# Altium schematic sheet 40_PP1_PWR.SchDoc
size 419 x 296 mm; Author: Serbinov O.A.; CompanyName: ELSICOM; DrawnBy: Serbinov O.A.; Engineer: Serbinov O.A.; Organization: Elsicom; Address1: Kirova avenue, 58; Address2: Tomsk; Address3: Russia 634012; DocumentNumber: 41; SheetNumber: 41; SheetTotal: 44; ProjectName: 48_PORTS
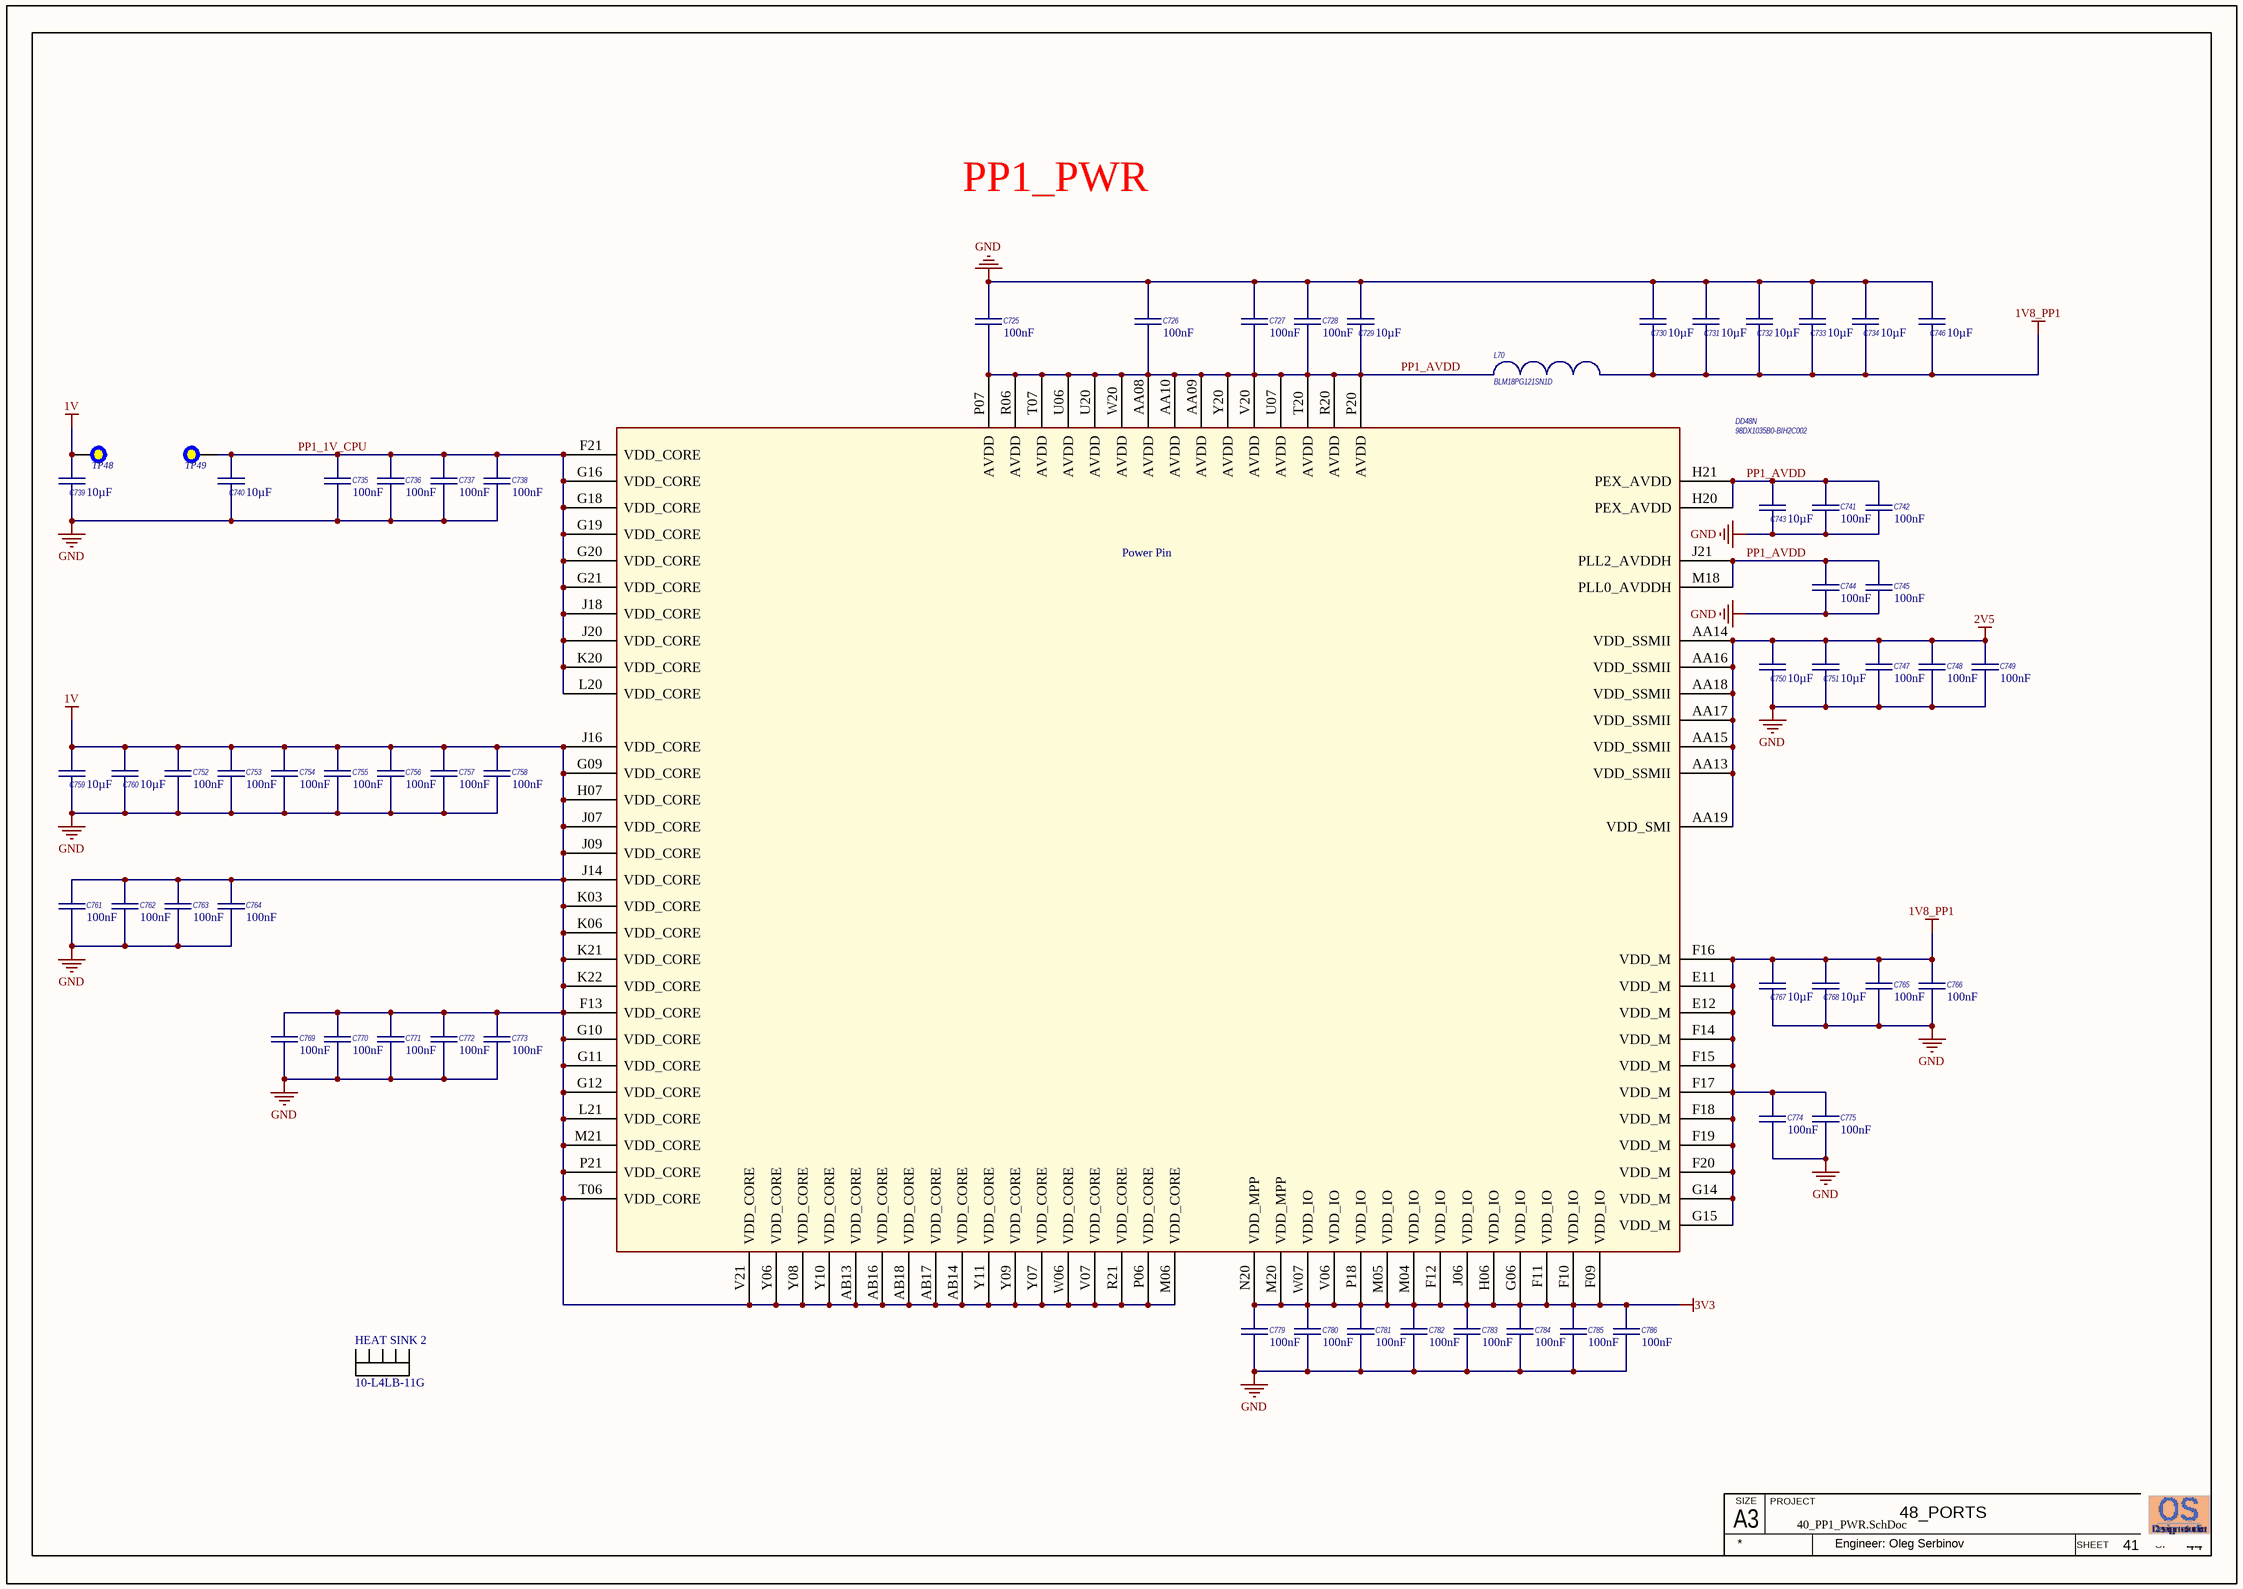
[diagram p0: 40_PP1_PWR.SchDoc]

## Parts
C725  Capacitance: 100nF  [C0402_IPC High Density]  (hidden comment: GRM155R71E104KE14D)
C726  Capacitance: 100nF  [C0402_IPC High Density]  (hidden comment: GRM155R71E104KE14D)
C727  Capacitance: 100nF  [C0402_IPC High Density]  (hidden comment: GRM155R71E104KE14D)
C728  Capacitance: 100nF  [C0402_IPC High Density]  (hidden comment: GRM155R71E104KE14D)
C729  Capacitance: 10µF  [CAPC2012[0805]]  (hidden comment: GRM21BR61C106KE15)
C730  Capacitance: 10µF  [CAPC2012[0805]]  (hidden comment: GRM21BR61C106KE15)
C731  Capacitance: 10µF  [CAPC2012[0805]]  (hidden comment: GRM21BR61C106KE15)
C732  Capacitance: 10µF  [CAPC2012[0805]]  (hidden comment: GRM21BR61C106KE15)
C733  Capacitance: 10µF  [CAPC2012[0805]]  (hidden comment: GRM21BR61C106KE15)
C734  Capacitance: 10µF  [CAPC2012[0805]]  (hidden comment: GRM21BR61C106KE15)
C735  Capacitance: 100nF  [C0402_IPC High Density]  (hidden comment: GRM155R71E104KE14D)
C736  Capacitance: 100nF  [C0402_IPC High Density]  (hidden comment: GRM155R71E104KE14D)
C737  Capacitance: 100nF  [C0402_IPC High Density]  (hidden comment: GRM155R71E104KE14D)
C738  Capacitance: 100nF  [C0402_IPC High Density]  (hidden comment: GRM155R71E104KE14D)
C739  Capacitance: 10µF  [CAPC2012[0805]]  (hidden comment: GRM21BR61C106KE15)
C740  Capacitance: 10µF  [CAPC2012[0805]]  (hidden comment: GRM21BR61C106KE15)
C741  Capacitance: 100nF  [C0402_IPC High Density]  (hidden comment: GRM155R71E104KE14D)
C742  Capacitance: 100nF  [C0402_IPC High Density]  (hidden comment: GRM155R71E104KE14D)
C743  Capacitance: 10µF  [CAPC2012[0805]]  (hidden comment: GRM21BR61C106KE15)
C744  Capacitance: 100nF  [C0402_IPC High Density]  (hidden comment: GRM155R71E104KE14D)
C745  Capacitance: 100nF  [C0402_IPC High Density]  (hidden comment: GRM155R71E104KE14D)
C746  Capacitance: 10µF  [CAPC2012[0805]]  (hidden comment: GRM21BR61C106KE15)
C747  Capacitance: 100nF  [C0402_IPC High Density]  (hidden comment: GRM155R71E104KE14D)
C748  Capacitance: 100nF  [C0402_IPC High Density]  (hidden comment: GRM155R71E104KE14D)
C749  Capacitance: 100nF  [C0402_IPC High Density]  (hidden comment: GRM155R71E104KE14D)
C750  Capacitance: 10µF  [CAPC2012[0805]]  (hidden comment: GRM21BR61C106KE15)
C751  Capacitance: 10µF  [CAPC2012[0805]]  (hidden comment: GRM21BR61C106KE15)
C752  Capacitance: 100nF  [C0402_IPC High Density]  (hidden comment: GRM155R71E104KE14D)
C753  Capacitance: 100nF  [C0402_IPC High Density]  (hidden comment: GRM155R71E104KE14D)
C754  Capacitance: 100nF  [C0402_IPC High Density]  (hidden comment: GRM155R71E104KE14D)
C755  Capacitance: 100nF  [C0402_IPC High Density]  (hidden comment: GRM155R71E104KE14D)
C756  Capacitance: 100nF  [C0402_IPC High Density]  (hidden comment: GRM155R71E104KE14D)
C757  Capacitance: 100nF  [C0402_IPC High Density]  (hidden comment: GRM155R71E104KE14D)
C758  Capacitance: 100nF  [C0402_IPC High Density]  (hidden comment: GRM155R71E104KE14D)
C759  Capacitance: 10µF  [CAPC2012[0805]]  (hidden comment: GRM21BR61C106KE15)
C760  Capacitance: 10µF  [CAPC2012[0805]]  (hidden comment: GRM21BR61C106KE15)
C761  Capacitance: 100nF  [C0402_IPC High Density]  (hidden comment: GRM155R71E104KE14D)
C762  Capacitance: 100nF  [C0402_IPC High Density]  (hidden comment: GRM155R71E104KE14D)
C763  Capacitance: 100nF  [C0402_IPC High Density]  (hidden comment: GRM155R71E104KE14D)
C764  Capacitance: 100nF  [C0402_IPC High Density]  (hidden comment: GRM155R71E104KE14D)
C765  Capacitance: 100nF  [C0402_IPC High Density]  (hidden comment: GRM155R71E104KE14D)
C766  Capacitance: 100nF  [C0402_IPC High Density]  (hidden comment: GRM155R71E104KE14D)
C767  Capacitance: 10µF  [CAPC2012[0805]]  (hidden comment: GRM21BR61C106KE15)
C768  Capacitance: 10µF  [CAPC2012[0805]]  (hidden comment: GRM21BR61C106KE15)
C769  Capacitance: 100nF  [C0402_IPC High Density]  (hidden comment: GRM155R71E104KE14D)
C770  Capacitance: 100nF  [C0402_IPC High Density]  (hidden comment: GRM155R71E104KE14D)
C771  Capacitance: 100nF  [C0402_IPC High Density]  (hidden comment: GRM155R71E104KE14D)
C772  Capacitance: 100nF  [C0402_IPC High Density]  (hidden comment: GRM155R71E104KE14D)
C773  Capacitance: 100nF  [C0402_IPC High Density]  (hidden comment: GRM155R71E104KE14D)
C774  Capacitance: 100nF  [C0402_IPC High Density]  (hidden comment: GRM155R71E104KE14D)
C775  Capacitance: 100nF  [C0402_IPC High Density]  (hidden comment: GRM155R71E104KE14D)
C779  Capacitance: 100nF  [C0402_IPC High Density]  (hidden comment: GRM155R71E104KE14D)
C780  Capacitance: 100nF  [C0402_IPC High Density]  (hidden comment: GRM155R71E104KE14D)
C781  Capacitance: 100nF  [C0402_IPC High Density]  (hidden comment: GRM155R71E104KE14D)
C782  Capacitance: 100nF  [C0402_IPC High Density]  (hidden comment: GRM155R71E104KE14D)
C783  Capacitance: 100nF  [C0402_IPC High Density]  (hidden comment: GRM155R71E104KE14D)
C784  Capacitance: 100nF  [C0402_IPC High Density]  (hidden comment: GRM155R71E104KE14D)
C785  Capacitance: 100nF  [C0402_IPC High Density]  (hidden comment: GRM155R71E104KE14D)
C786  Capacitance: 100nF  [C0402_IPC High Density]  (hidden comment: GRM155R71E104KE14D)
DD48  98DX1035B0-BIH2C002  [HSBGA617_27X27_1MM]  (part N of 16)
HEAT_SINK_2  10-L4LB-11G  [10-L4LB-11G]  (no BOM)
L70  BLM18PG121SN1D  [INDC1608X95N]
TP48  Test Point 0.5mm pad  [Test Point 0.5mm]  (value not drawn)  (no BOM)
TP49  Test Point 0.5mm pad  [Test Point 0.5mm]  (value not drawn)  (no BOM)

## Nets
1V: C739.2 C752.1 C753.1 C754.1 C755.1 C756.1 C757.1 C758.1 C759.2 C760.2 C761.1 C762.1 C763.1 C764.1 C769.1 C770.1 C771.1 C772.1 C773.1 DD48.AB13(VDD_CORE) DD48.AB14(VDD_CORE) DD48.AB16(VDD_CORE) DD48.AB17(VDD_CORE) DD48.AB18(VDD_CORE) DD48.F13(VDD_CORE) DD48.G09(VDD_CORE) DD48.G10(VDD_CORE) DD48.G11(VDD_CORE) DD48.G12(VDD_CORE) DD48.H07(VDD_CORE) DD48.J07(VDD_CORE) DD48.J09(VDD_CORE) DD48.J14(VDD_CORE) DD48.J16(VDD_CORE) DD48.K03(VDD_CORE) DD48.K06(VDD_CORE) DD48.K21(VDD_CORE) DD48.K22(VDD_CORE) DD48.L21(VDD_CORE) DD48.M06(VDD_CORE) DD48.M21(VDD_CORE) DD48.P06(VDD_CORE) DD48.P21(VDD_CORE) DD48.R21(VDD_CORE) DD48.T06(VDD_CORE) DD48.V07(VDD_CORE) DD48.V21(VDD_CORE) DD48.W06(VDD_CORE) DD48.Y06(VDD_CORE) DD48.Y07(VDD_CORE) DD48.Y08(VDD_CORE) DD48.Y09(VDD_CORE) DD48.Y10(VDD_CORE) DD48.Y11(VDD_CORE) TP48.1
1V8_PP1: C730.1 C731.1 C732.1 C733.1 C734.1 C746.1 C765.1 C766.1 C767.2 C768.2 C774.1 C775.1 DD48.E11(VDD_M) DD48.E12(VDD_M) DD48.F14(VDD_M) DD48.F15(VDD_M) DD48.F16(VDD_M) DD48.F17(VDD_M) DD48.F18(VDD_M) DD48.F19(VDD_M) DD48.F20(VDD_M) DD48.G14(VDD_M) DD48.G15(VDD_M) L70.2
2V5: C747.1 C748.1 C749.1 C750.2 C751.2 DD48.AA13(VDD_SSMII) DD48.AA14(VDD_SSMII) DD48.AA15(VDD_SSMII) DD48.AA16(VDD_SSMII) DD48.AA17(VDD_SSMII) DD48.AA18(VDD_SSMII) DD48.AA19(VDD_SMI)
3V3: C779.1 C780.1 C781.1 C782.1 C783.1 C784.1 C785.1 C786.1 DD48.F09(VDD_IO) DD48.F10(VDD_IO) DD48.F11(VDD_IO) DD48.F12(VDD_IO) DD48.G06(VDD_IO) DD48.H06(VDD_IO) DD48.J06(VDD_IO) DD48.M04(VDD_IO) DD48.M05(VDD_IO) DD48.M20(VDD_MPP) DD48.N20(VDD_MPP) DD48.P18(VDD_IO) DD48.V06(VDD_IO) DD48.W07(VDD_IO)
GND: C725.1 C726.1 C727.1 C728.1 C729.2 C730.2 C731.2 C732.2 C733.2 C734.2 C735.2 C736.2 C737.2 C738.2 C739.1 C740.1 C741.2 C742.2 C743.1 C744.2 C745.2 C746.2 C747.2 C748.2 C749.2 C750.1 C751.1 C752.2 C753.2 C754.2 C755.2 C756.2 C757.2 C758.2 C759.1 C760.1 C761.2 C762.2 C763.2 C764.2 C765.2 C766.2 C767.1 C768.1 C769.2 C770.2 C771.2 C772.2 C773.2 C774.2 C775.2 C779.2 C780.2 C781.2 C782.2 C783.2 C784.2 C785.2 C786.2
PP1_1V_CPU: C735.1 C736.1 C737.1 C738.1 C740.2 DD48.F21(VDD_CORE) DD48.G16(VDD_CORE) DD48.G18(VDD_CORE) DD48.G19(VDD_CORE) DD48.G20(VDD_CORE) DD48.G21(VDD_CORE) DD48.J18(VDD_CORE) DD48.J20(VDD_CORE) DD48.K20(VDD_CORE) DD48.L20(VDD_CORE) TP49.1
PP1_AVDD: C725.2 C726.2 C727.2 C728.2 C729.1 C741.1 C742.1 C743.2 C744.1 C745.1 DD48.AA08(AVDD) DD48.AA09(AVDD) DD48.AA10(AVDD) DD48.H20(PEX_AVDD) DD48.H21(PEX_AVDD) DD48.J21(PLL2_AVDDH) DD48.M18(PLL0_AVDDH) DD48.P07(AVDD) DD48.P20(AVDD) DD48.R06(AVDD) DD48.R20(AVDD) DD48.T07(AVDD) DD48.T20(AVDD) DD48.U06(AVDD) DD48.U07(AVDD) DD48.U20(AVDD) DD48.V20(AVDD) DD48.W20(AVDD) DD48.Y20(AVDD) L70.1

## Notes on the sheet
- PP1_PWR
- A3
- SIZE
- PROJECT
- SHEET
- OF
- Engineer: Oleg Serbinov
- (in symbol 98DX1035A1-BIH2C002, part N) Power Pin

## Library data of the parts
C725-C728 C735-C738 C741 C742 C744 C745 C747-C749 C752-C758 C761-C766 C769-C775 C779-C786 = GRM155R71E104KE14D: C0402, 100nF, 25V, X7R; Manufacturer: Murata; Rmanufacturer: Yageo  Samsung  TDK  Taiyo Yuden  Kemet; Customer Part Number: Конденсатор, 100n, 0402, 25V, X7R, 10%; Capacitance Tolerance: ± 10%; Voltage Rating: 16; Capacitor Case Style: 0402 [1005 Metric]; Capacitor Terminals: SMD; SVHC: No SVHC (19-Dec-2012); No. of Pins: 2; Reel Quantity: 10000; Tolerance +: 10%; Analogs: any suitable; Manufacturer Part Number: GRM155R71E104KE14D; RoHS: YES; Packaging: Reel; Package / Case: 0402; ComponentLink1URL: http://www.farnell.com/datasheets/4360.pdf; ComponentLink1Description: http://www.farnell.com/datasheets/4360.pdf; Pricing: 10000=0.008593, 30000=0.007991 (GBP); Supplier 1: Farnell; Supplier Part Number 1: 1118151; Stock: 3; Dielectric Characteristic: X7R; Operating Temperature Min: -55; Operating Temperature Max: 125; Operating Temperature Range: -55°C to +125; Series: GRM Hi-Cap; Terminal Type: Surface Mount (SMD, SMT); Tolerance -: 10%; Voltage Rating V DC: 16
C729-C734 C739 C740 C743 C746 C750 C751 C759 C760 C767 C768 = GRM21BR61C106KE15: C0805, 10uF 10%, 16V, X5R; Manufacturer: Murata; Customer Part Number: Конденсатор, 10u, 0805, 16V, X5R, 10%; Analogs: any suitable; Applications: General Purpose; Category: Capacitors; Operating Temperature: -55°C ~ 85°C; Package / Case: 0805 (2012 Metric); Size / Dimension: 0.079" L x 0.049" W (2.00mm x 1.25mm); Temperature Coefficient: X5R; Tolerance: ±10%; ComponentLink1URL: http://search.murata.co.jp/Ceramy/image/img/PDF/ENG/GRM21BR61C106KE15.pdf; ComponentLink1Description: http://search.murata.co.jp/Ceramy/image/img/PDF/ENG/GRM21BR61C106KE15.pdf; Pricing: 1=0.3, 10=0.25, 50=0.1408, 100=0.1252, 250=0.09392, 500=0.08294, 1000=0.07356 (USD); Voltage - Rated: 16V; Manufacturer Part Number: GRM21BR61C106KE15
DD48 = 98DX1035A1-BIH2C002: IC 24-PORT FE  4-PORT 2.5GE L2 ENTRY-LEVEL, CPU; Customer Part Number: Микросхема, 98DX1035B0-BIH2C002, IC 24-PORT FE 4-PORT 2.5GE L2 ENTRY-LEVEL, HSBGA617SBGA617; Manufacturer: Marvell Technology Group; Manufacturer Part Number: 98DX1035B0-BIH2C002
HEAT_SINK_2 = 10-L4LB-11G: HEAT SINK  45.2x41.4; Manufacturer: Aavid Thermalloy; Customer Part Number: Радиатор, 10-L4LB-11G, Pin Fin heat sink with Push Pin attachment; Manufacturer Part Number: 10-L4LB-11G
L70 = BLM18PG121SN1D: FILTER BLM18 (0603, 2A); Manufacturer: Murata; Rpart number: MPZ1608S121ATAH0 ; CIC10P121NC ; MPZ1608S121ATDH5 ; BLM18PG121SH1D ; 742792625; Rmanufacturer: Boruns  Samsung  TDK  Murata  Wurth Electronics; Customer Part Number: Дроссель, BLM18PG121SN1D, FERRITE BEAD 120 OHM 1LN, 0603; DC Resistance Max: 0.05; Impedance: 120; Ferrite Mounting: SMD; Inductor Type: Ferrite Bead; SVHC: No SVHC (19-Dec-2011); Ferrite Case Style: 0603 / 1608; Core Material: Ferrite; DC Current Max: 2000; Inductor Case Style: 0603; Inductance Tolerance: ± 25%; No. of Pins: 2; RoHS: YES; Operating Temperature Min: -55; Mounting Type: SMD; Operating Temperature Max: +125; Package / Case: 0603; Impedance @ 100MHz Typ: 120; Resistance: 0.05; Supplier Part Number: 1515738; Supplier: Farnell; ComponentLink1URL: http://www.farnell.com/datasheets/5148.pdf; ComponentLink1Description: http://www.farnell.com/datasheets/5148.pdf; Pricing: 5=0.056, 50=0.041, 100=0.034, 250=0.028, 500=0.027 (GBP); Manufacturer Part Number: BLM18PG121SN1D; DC Current Rating: 2A; Analogs: MPZ1608S121ATAH0 ; CIC10P121NC ; MPZ1608S121ATDH5 ; BLM18PG121SH1D ; 742792625